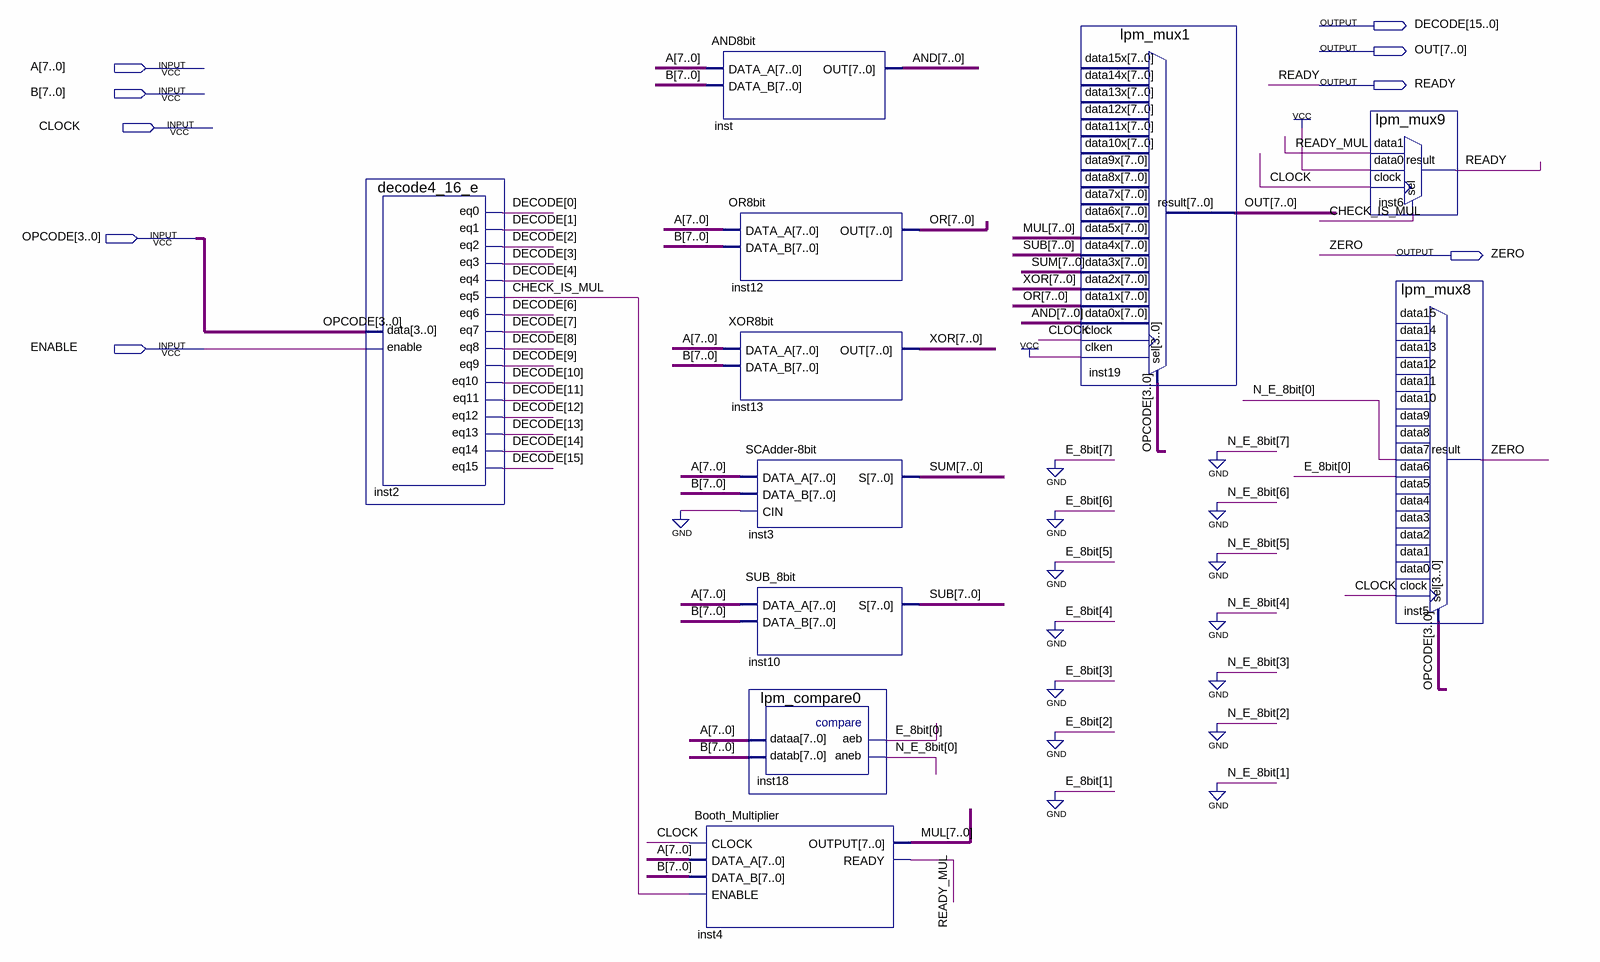
[diagram p0: schematic sheet]
// Quartus schematic Practical3.bdf as structural Verilog: 11 symbols, 9 pins
module Practical3 (
  input  [7:0] A,
  input  [7:0] B,
  input  CLOCK,
  input  [3:0] OPCODE,
  input  ENABLE,
  output [15:0] DECODE,
  output [7:0] OUT,
  output READY,
  output ZERO
);

  wire CHECK_IS_MUL, READY_MUL;
  wire [0:0] E_8bit, N_E_8bit;
  wire [7:0] AND, MUL, OR, SUB, SUM, XOR;

  decode4_16_e inst2 (
    .data(OPCODE), .enable(ENABLE), .eq0(DECODE[0]), .eq1(DECODE[1]), .eq2(DECODE[2]), .eq3(DECODE[3]),
    .eq4(DECODE[4]), .eq5(CHECK_IS_MUL), .eq6(DECODE[6]), .eq7(DECODE[7]), .eq8(DECODE[8]), .eq9(DECODE[9]),
    .eq10(DECODE[10]), .eq11(DECODE[11]), .eq12(DECODE[12]), .eq13(DECODE[13]), .eq14(DECODE[14]),
    .eq15(DECODE[15]));
  AND8bit inst (.DATA_A(A), .DATA_B(B), .OUT(AND));
  OR8bit inst12 (.DATA_A(A), .DATA_B(B), .OUT(OR));
  XOR8bit inst13 (.DATA_A(A), .DATA_B(B), .OUT(XOR));
  \SCAdder-8bit  inst3 (.DATA_A(A), .DATA_B(B), .CIN(1'b0), .S(SUM));
  SUB_8bit inst10 (.DATA_A(A), .DATA_B(B), .S(SUB));
  lpm_compare0 inst18 (.dataa(A), .datab(B), .aeb(E_8bit[0]), .aneb(N_E_8bit[0]));
  Booth_Multiplier inst4 (
    .CLOCK(CLOCK), .DATA_A(A), .DATA_B(B), .ENABLE(CHECK_IS_MUL), .OUTPUT(MUL), .READY(READY_MUL));
  lpm_mux1 inst19 (
    .data5x(MUL), .data4x(SUB), .data3x(SUM), .data2x(XOR), .data1x(OR), .data0x(AND), .clock(CLOCK),
    .clken(1'b1), .sel(OPCODE), .result(OUT));  // open: data15x, data14x, data13x, data12x, data11x, data10x, data9x, data8x, data7x, data6x
  lpm_mux9 inst6 (.data1(READY_MUL), .data0(1'b1), .clock(CLOCK), .sel(CHECK_IS_MUL), .result(READY));
  lpm_mux8 inst5 (
    .data7(N_E_8bit[0]), .data6(E_8bit[0]), .clock(CLOCK), .sel(OPCODE), .result(ZERO));  // open: data15, data14, data13, data12, data11, data10, data9, data8, data5, data4, data3, data2, data1, data0
endmodule
